# EAGLE schematic circuit (EAGLE 9.6.2)
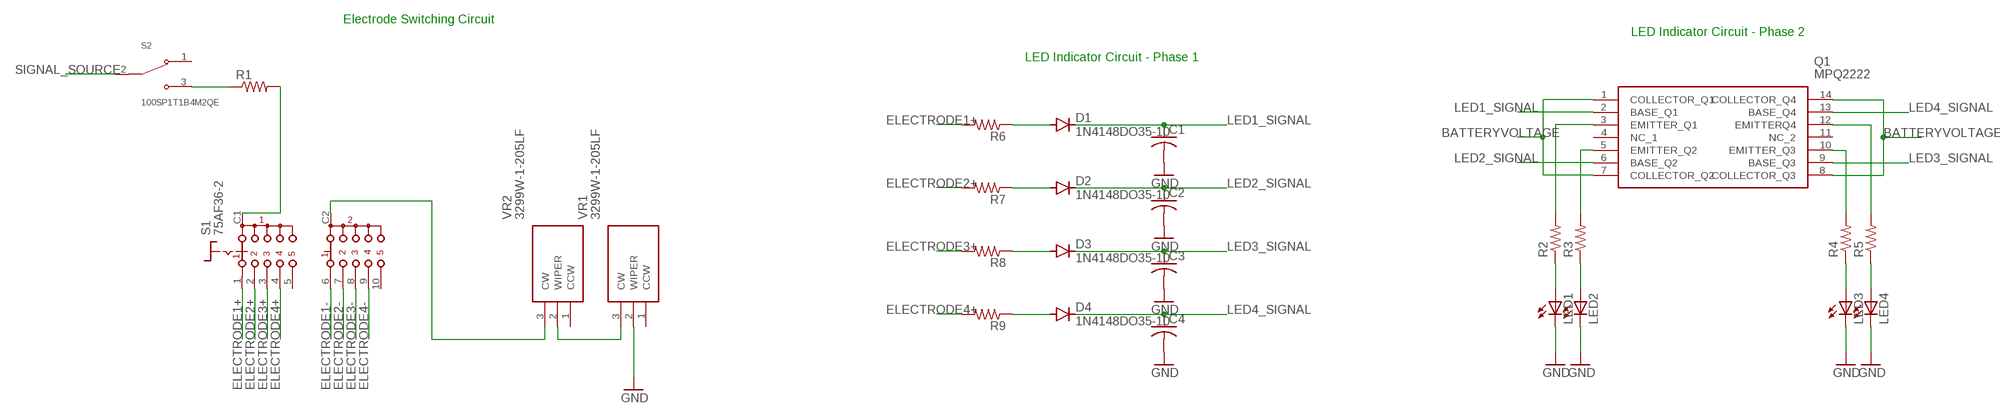
[diagram p0: schematic, sheet 1]

## Parts
C1  C-US025-024X044  [C025-024X044]
C2  C-US025-024X044  [C025-024X044]
C3  C-US025-024X044  [C025-024X044]
C4  C-US025-024X044  [C025-024X044]
D1  1N4148DO35-10  [DO35-10]
D2  1N4148DO35-10  [DO35-10]
D3  1N4148DO35-10  [DO35-10]
D4  1N4148DO35-10  [DO35-10]
LED1  LED5MM  [LED5MM]
LED2  LED5MM  [LED5MM]
LED3  LED5MM  [LED5MM]
LED4  LED5MM  [LED5MM]
Q1  MPQ2222  [DIP890W60P250L1905H440Q14N]
R1  R-US_0204/7  [0204/7]
R2  R-US_0204/7  [0204/7]
R3  R-US_0204/7  [0204/7]
R4  R-US_0204/7  [0204/7]
R5  R-US_0204/7  [0204/7]
R6  R-US_0204/7  [0204/7]
R7  R-US_0204/7  [0204/7]
R8  R-US_0204/7  [0204/7]
R9  R-US_0204/7  [0204/7]
S1  75AF36-2  [75AF36-2]
S2  100SP1T1B4M2QE  [SW_100SP1T1B4M2QE]
VR1  3299W-1-205LF  [3299W-1-104LF_1]
VR2  3299W-1-205LF  [3299W-1-104LF_1]

## Nets
BATTERYVOLTAGE: Q1.1(COLLECTOR_Q1) Q1.8(COLLECTOR_Q3) Q1.14(COLLECTOR_Q4)
ELECTRODE1+: R6.2 S1.1
ELECTRODE1-: S1.6
ELECTRODE2+: R7.2 S1.2
ELECTRODE2-: S1.7
ELECTRODE3+: R8.2 S1.3
ELECTRODE3-: S1.8
ELECTRODE4+: R9.2 S1.4
ELECTRODE4-: S1.9
GND: C1.2 C2.2 C3.2 C4.2 LED1.K(C) LED2.K(C) LED3.K(C) LED4.K(C) VR1.2(WIPER)
LED1_SIGNAL: C1.1 D1.C Q1.2(BASE_Q1)
LED2_SIGNAL: C2.1 D2.C Q1.6(BASE_Q2)
LED3_SIGNAL: C3.1 D3.C Q1.9(BASE_Q3)
LED4_SIGNAL: C4.1 D4.C Q1.13(BASE_Q4)
N$1: R1.1 S2.3
N$2: R1.2 S1.C1
N$3: S1.C2 VR2.3(CW)
N$4: VR1.3(CW) VR2.2(WIPER)
N$5: Q1.3(EMITTER_Q1) R2.2
N$6: Q1.5(EMITTER_Q2) R3.2
N$7: Q1.7(COLLECTOR_Q2)
N$8: Q1.12(EMITTERQ4) R5.2
N$9: Q1.10(EMITTER_Q3) R4.2
N$10: LED1.A R2.1
N$11: LED2.A R3.1
N$12: LED3.A R4.1
N$13: LED4.A R5.1
N$14: D1.A R6.1
N$16: D2.A R7.1
N$18: D3.A R8.1
N$20: D4.A R9.1
SIGNAL_SOURCE: S2.2
Unconnected: Q1.4(NC_1) Q1.11(NC_2) S1.5 S1.10 S2.1 VR1.1(CCW) VR2.1(CCW)

## Notes on the sheet
- Electrode Switching Circuit
- LED Indicator Circuit - Phase 2
- LED Indicator Circuit - Phase 1

## Library data of the parts
C1-C4 = adafruit:C-US: CAPACITOR, American symbol
D1-D4 = diode:1N4148: DIODE high speed (Philips)
LED1-LED4 = adafruit:LED: LED OSRAM: - CHIPLED LG R971, LG N971, LY N971, LG Q971, LY Q971, LO R971, LY R971 LH N974, LH R974 LS Q976, LO Q976, LY Q976 LO Q996 - Hyper CHIPLED LW Q18S LB Q993, LB Q99A, LB R99A - SideLED LS A670, LO A670, LY A670, LG A670, LP A670 LB A673, LV A673, LT A673, LW A673 LH A674 LY A675 LS A676, LA A676, LO A676, LY A676, LW A676 LS A679, LY A679, LG A679 - Hyper Micro SIDELED® LS Y876, LA Y876, LO Y876, LY Y876 LT Y87S - SmartLED LW L88C, LW L88S LB L89C, LB L89S, LG L890 LS L89K, LO L89K, LY L89K LS L896, LA L896, LO L896, LY L896 - TOPLED LS T670, LO T670, LY T670, LG T670, LP T670 LSG T670, LSP T670, LSY T670, LOP T670, LYG T670 LG T671, LOG T671, LSG T671 LB T673, LV T673, LT T673, LW T673 LH T674 LS T676, LA T676, LO T676, LY T676, LB T676, LH T676, LSB T676, LW T676 LB T67C, LV T67C, LT T67C, LS T67K, LO T67K, LY T67K, LW E67C LS E67B, LA E67B, LO E67B, LY E67B, LB E67C, LV E67C, LT E67C LW T67C LS T679, LY T679, LG T679 LS T770, LO T770, LY T770, LG T770, LP T770 LB T773, LV T773, LT T773, LW T773 LH T774 LS E675, LA E675, LY E675, LS T675 LS T776, LA T776, LO T776, LY T776, LB T776 LHGB T686 LT T68C, LB T68C - Hyper Mini TOPLED® LB M676 - Mini TOPLED Santana® LG M470 LS M47K, LO M47K, LY M47K Source: http://www.osram.convergy.de/
Q1 = MPQ2222:MPQ2222: Bipolar Transistors - BJT Small Signal Transistor Source: Datasheet <https://my.centralsemi.com/get_document.php?cmp=1&mergetype=pd&mergepath=pd&pdf_id=mpq2222.PDF>; DESCRIPTION: Bipolar Transistors - BJT Small Signal Transistor; HEIGHT: 4.4mm; MANUFACTURER_NAME: Central Semiconductor; MANUFACTURER_PART_NUMBER: MPQ2222; MOUSER_PART_NUMBER: 610-MPQ2222; MOUSER_PRICE-STOCK: https://www.mouser.com/Search/Refine.aspx?Keyword=610-MPQ2222
R1-R9 = adafruit:R-US_: RESISTOR, American symbol
S1 = switch:75?36-2: Single Deck Rotary Switches Source: www.grayhill.com .. J-13-14.pdf
S2 = 100SP1T1B4M2QE:100SP1T1B4M2QE: Toggle Switch SPDT Through Hole Check prices <https://pricing.snapeda.com/search/part/100SP1T1B4M2QE/?ref=eda>; AVAILABILITY: Good; DESCRIPTION: Toggle Switch SPDT Through Hole; MF: E-Switch; MP: 100SP1T1B4M2QE; PACKAGE: None; PRICE: None; PURCHASE-URL: https://pricing.snapeda.com/search/part/100SP1T1B4M2QE/?ref=eda
VR1 VR2 = 3299W-1-205LF:3299W-1-205LF: Bourns 25-Turn Through Hole Cermet Trimmer Resistor with Solder Pin Terminations, 2M +/-10% 0.5W +/-100ppm/C Source: Datasheet <https://www.bourns.com/pdfs/3299.pdf>; ARROW_PART_NUMBER: 3299W-1-205LF; ARROW_PRICE-STOCK: https://www.arrow.com/en/products/3299w-1-205lf/bourns; DESCRIPTION: Bourns 25-Turn Through Hole Cermet Trimmer Resistor with Solder Pin Terminations, 2M +/-10% 0.5W +/-100ppm/C; HEIGHT: mm; MANUFACTURER_NAME: Bourns; MANUFACTURER_PART_NUMBER: 3299W-1-205LF; MOUSER_PART_NUMBER: 652-3299W-1-205LF; MOUSER_PRICE-STOCK: https://www.mouser.co.uk/ProductDetail/Bourns/3299W-1-205LF?qs=9SgaW23vEMhaBzsBvEysbw%3D%3D